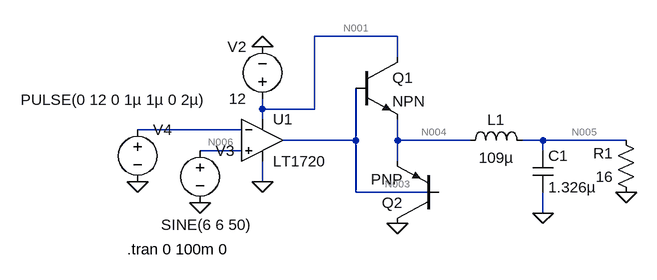
[diagram p0: schematic lab_3_full.asc]
lab_3_full.asc, the LTspice schematic file:
Version 4
SHEET 1 880 680
WIRE 384 -16 256 -16
WIRE 384 16 384 -16
WIRE 176 96 176 80
WIRE 256 96 256 -16
WIRE 256 96 176 96
WIRE 176 112 176 96
WIRE 144 128 -16 128
WIRE 320 144 320 64
WIRE 320 144 208 144
WIRE 384 144 384 112
WIRE 496 144 384 144
WIRE 608 144 576 144
WIRE 736 144 608 144
WIRE 144 160 80 160
WIRE 608 160 608 144
WIRE 384 176 384 144
WIRE 176 208 176 176
WIRE 320 224 320 144
WIRE 448 224 320 224
WIRE 608 256 608 224
FLAG 176 208 0
FLAG 176 0 0
FLAG -16 208 0
FLAG 80 240 0
FLAG 608 256 0
FLAG 736 224 0
FLAG 384 272 0
SYMBOL voltage 176 96 R180
WINDOW 0 24 96 Left 2
WINDOW 3 24 16 Left 2
WINDOW 123 0 0 Left 0
WINDOW 39 0 0 Left 0
SYMATTR InstName V2
SYMATTR Value 12
SYMBOL voltage 80 144 R0
WINDOW 3 -60 130 Left 2
WINDOW 123 0 0 Left 0
WINDOW 39 0 0 Left 0
SYMATTR Value SINE(6 6 50)
SYMATTR InstName V3
SYMBOL voltage -16 112 R0
WINDOW 3 -180 -30 Left 2
WINDOW 123 0 0 Left 0
WINDOW 39 0 0 Left 0
SYMATTR Value PULSE(0 12 0 1µ 1µ 0 2µ)
SYMATTR InstName V4
SYMBOL res 752 240 R180
WINDOW 0 36 76 Left 2
WINDOW 3 36 40 Left 2
SYMATTR InstName R1
SYMATTR Value 16
SYMBOL cap 592 160 R0
SYMATTR InstName C1
SYMATTR Value 1.326µ
SYMBOL ind 480 160 R270
WINDOW 0 32 56 VTop 2
WINDOW 3 5 56 VBottom 2
SYMATTR InstName L1
SYMATTR Value 109µ
SYMBOL Comparators\\LT1720 176 80 R0
SYMATTR InstName U1
SYMBOL npn 320 16 R0
SYMATTR InstName Q1
SYMBOL pnp 448 272 R180
SYMATTR InstName Q2
TEXT -32 312 Left 2 !.tran 0 100m 0

The netlist it stands for:
* lab_3_full.asc
V2 N001 0 12
V3 N006 0 SINE(6 6 50)
V4 N002 0 PULSE(0 12 0 1µ 1µ 0 2µ)
R1 0 N005 16
C1 N005 0 1.326µ
L1 N004 N005 109µ
XU1 N006 N002 N001 0 N003 LT1720  ; pins In+ In- V+ V- OUT
Q1 N001 N003 N004 0 NPN
Q2 0 N003 N004 0 PNP
.model NPN NPN
.model PNP PNP
.lib standard.bjt
.tran 0 100m 0
.lib LT1720.sub
.backanno
.end

* Results of the author's LTspice run, read from the files saved beside the schematic
* Operating Point, zero values left out:
*   V(n001) = 12 V
*   V(n006) = 6 V
*   V(n005) = 10.73 V
*   V(n004) = 10.73 V
*   V(n003) = 11.67 V
*   Ic(Q1) = 663.8 mA
*   Ib(Q1) = 6.638 mA
*   Ie(Q1) = -670.5 mA
*   Ic(Q2) = -11.67 pA
*   Ib(Q2) = 12.61 pA
*   I(L1) = 670.5 mA
*   I(R1) = -670.5 mA
*   I(V2) = -678 mA
*   I(V3) = 100 pA
*   I(V4) = 5 µA
*   Ix(u1:1) = -100 pA
*   Ix(u1:2) = -5 µA
*   Ix(u1:3) = 14.15 mA
*   Ix(u1:4) = -7.503 mA
*   Ix(u1:5) = -6.638 mA